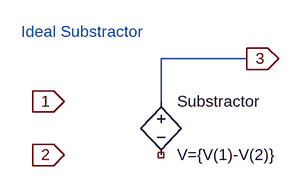
[diagram p0: schematic substractor.asc]
substractor.asc, the LTspice schematic file:
Version 4
SHEET 1 880 680
WIRE 320 48 192 48
WIRE 192 112 192 48
FLAG 48 112 1
IOPIN 48 112 In
FLAG 48 192 2
IOPIN 48 192 In
FLAG 320 48 3
IOPIN 320 48 Out
SYMBOL bv 192 96 R0
SYMATTR InstName Substractor
SYMATTR Value V={V(1)-V(2)}
TEXT -16 8 Left 2 ;Ideal Substractor

The netlist it stands for:
* substractor.asc
B§Substractor 3 NC_01 V={V(1)-V(2)}
* Ideal Substractor
.backanno
.end